# Altium schematic sheet STM_board.SchDoc
size A4; SheetNumber: 7; SheetTotal: 8
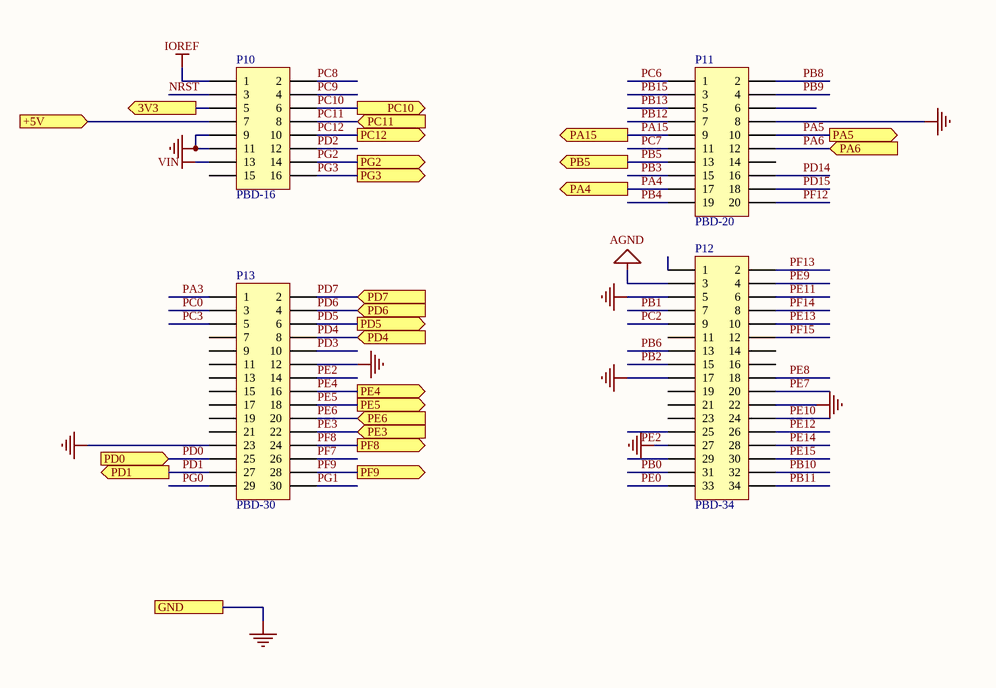
[diagram p0: STM_board.SchDoc]

## Parts
P10  PBD-16  [PBD-16]
P11  PBD-20  [PBD-20]
P12  PBD-34  [PBD-34]
P13  PBD-30  [PBD-30]

## Ports
3V3 (out), +5V (in), GND, PA4 (out), PA5 (out), PA6 (in), PA15 (out), PB5 (out), PC10 (out), PC11 (in), PC12 (out), PD0 (in), PD1 (out), PD4 (in), PD5 (out), PD6 (in), PD7 (in), PE3 (in), PE4 (out), PE5 (out), PE6 (in), PF8 (out), PF9 (out), PG2 (out), PG3 (out)

## Nets
AGND: P12.3
GND: P10.9 P10.11 P11.8 P12.5 P12.17 P12.22 P12.27 P13.12 P13.23 ; port GND
IOREF: P10.1
VIN: P10.13
3V3: P10.5 ; port 3V3
+5V: P10.7 ; port +5V
NRST: P10.3
PA3: P13.1
PA4: P11.17 ; port PA4
PA5: P11.10 ; port PA5
PA6: P11.12 ; port PA6
PA15: P11.9 ; port PA15
PB0: P12.31
PB1: P12.7
PB2: P12.15
PB3: P11.15
PB4: P11.19
PB5: P11.13 ; port PB5
PB6: P12.13
PB8: P11.2
PB9: P11.4
PB10: P12.32
PB11: P12.34
PB12: P11.7
PB13: P11.5
PB15: P11.3
PC0: P13.3
PC2: P12.9
PC3: P13.5
PC6: P11.1
PC7: P11.11
PC8: P10.2
PC9: P10.4
PC10: P10.6 ; port PC10
PC11: P10.8 ; port PC11
PC12: P10.10 ; port PC12
PD0: P13.25 ; port PD0
PD1: P13.27 ; port PD1
PD2: P10.12
PD3: P13.10
PD4: P13.8 ; port PD4
PD5: P13.6 ; port PD5
PD6: P13.4 ; port PD6
PD7: P13.2 ; port PD7
PD14: P11.16
PD15: P11.18
PE0: P12.33
PE2: P13.14
PE3: P13.22 ; port PE3
PE4: P13.16 ; port PE4
PE5: P13.18 ; port PE5
PE6: P13.20 ; port PE6
PE7: P12.20
PE8: P12.18
PE9: P12.4
PE10: P12.24
PE11: P12.6
PE12: P12.26
PE13: P12.10
PE14: P12.28
PE15: P12.30
PF7: P13.26
PF8: P13.24 ; port PF8
PF9: P13.28 ; port PF9
PF12: P11.20
PF13: P12.2
PF14: P12.8
PF15: P12.12
PG0: P13.29
PG1: P13.30
PG2: P10.14 ; port PG2
PG3: P10.16 ; port PG3

Not connected (* = marked no-connect by the designer): P10 15; P11 6 14; P12 1 11 14 16 19 21 23 25 29; P13 7 9 11 13 15 17 19 21

## Notes on the sheet
- Labels drawn without touching a wire or pin: PE2

## Library data of the parts
P10 = PBD-16: Гнездо на плату; Производитель: Connfly electronic (Zhenqin); Номинал: 1А; Напряжение: 300В; Вид монтажа: DIP; Тип элемента: Разъем; Температурный диапазон: -55…140; Примечание: шаг 2.54 мм; Название: PBD-16; Артикул: PBD-16
P11 = PBD-20: Гнездо на плату; Производитель: Connfly electronic (Zhenqin); Номинал: 1А; Напряжение: 300В; Вид монтажа: DIP; Тип элемента: Разъем; Температурный диапазон: -55…140; Примечание: шаг 2.54 мм; Название: PBD-20; Артикул: PBD-20
P12 = PBD-34: Гнездо на плату; Производитель: Connfly electronic (Zhenqin); Номинал: 1А; Напряжение: 300В; Вид монтажа: DIP; Тип элемента: Разъем; Температурный диапазон: -55…140; Примечание: шаг 2.54 мм; Название: PBD-34; Артикул: PBD-34
P13 = PBD-30: Гнездо на плату; Производитель: Connfly electronic (Zhenqin); Номинал: 1А; Напряжение: 300В; Вид монтажа: DIP; Тип элемента: Разъем; Температурный диапазон: -55…140; Примечание: шаг 2.54 мм; Название: PBD-30; Артикул: PBD-30